# EAGLE design Helmet_Drop_V1.5 (EAGLE 9.6.2)

## Sheet 1 of 2
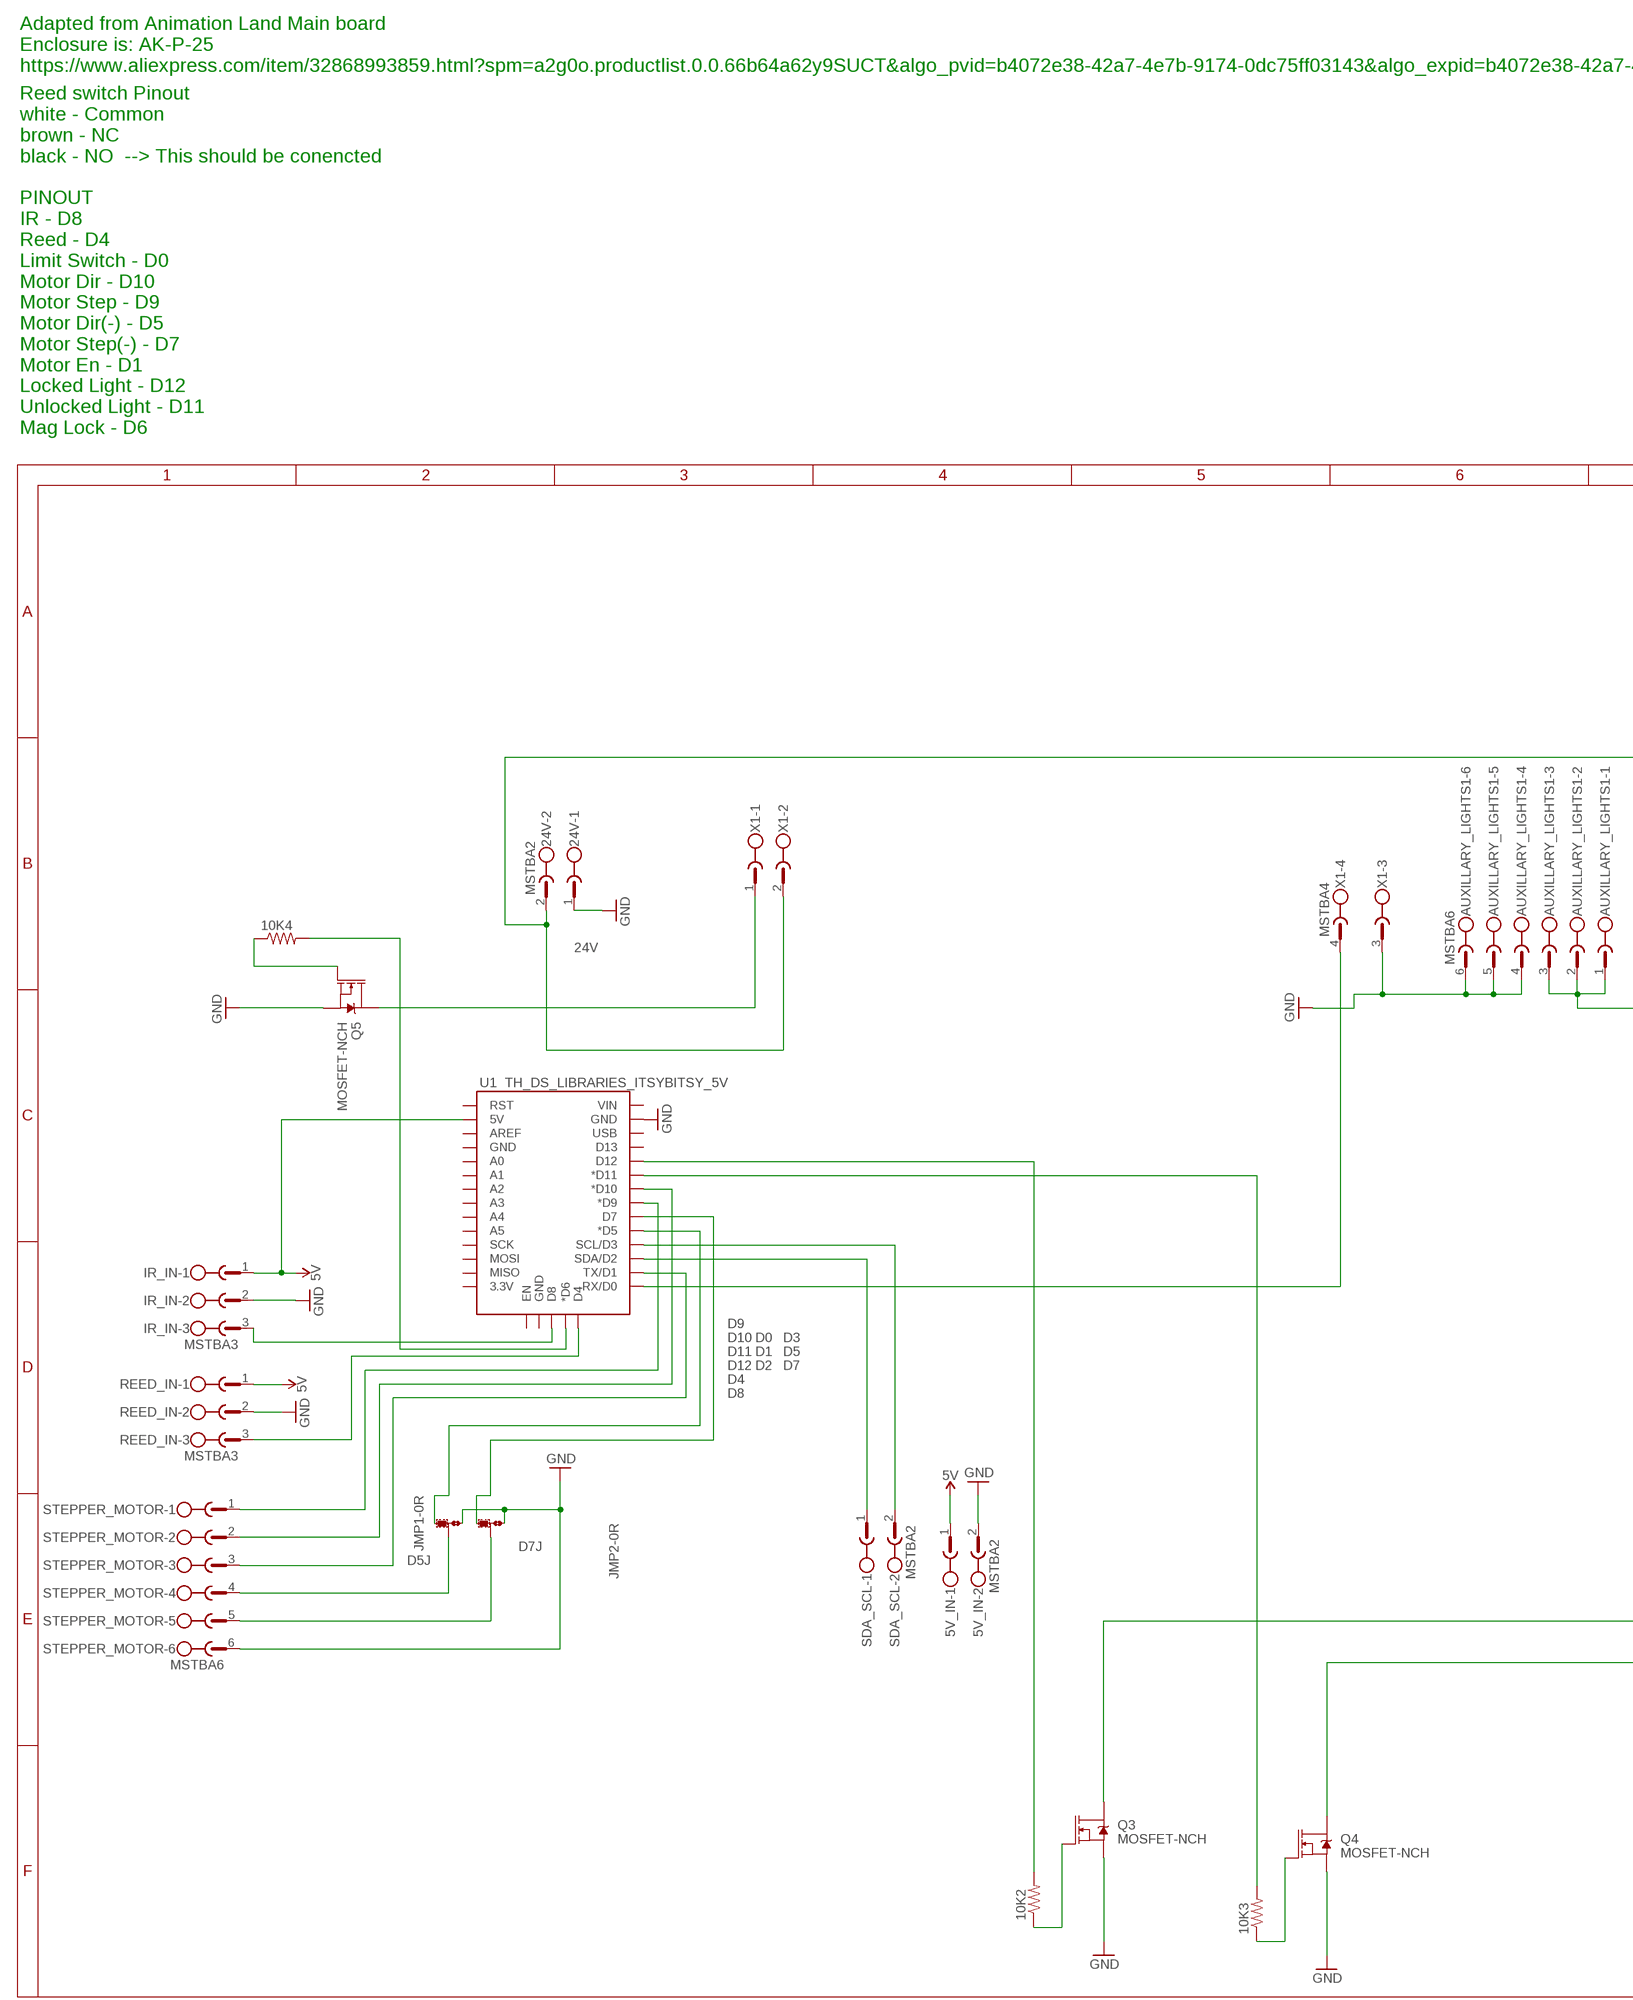
[diagram p0: schematic, sheet 1, part 1 of 2]
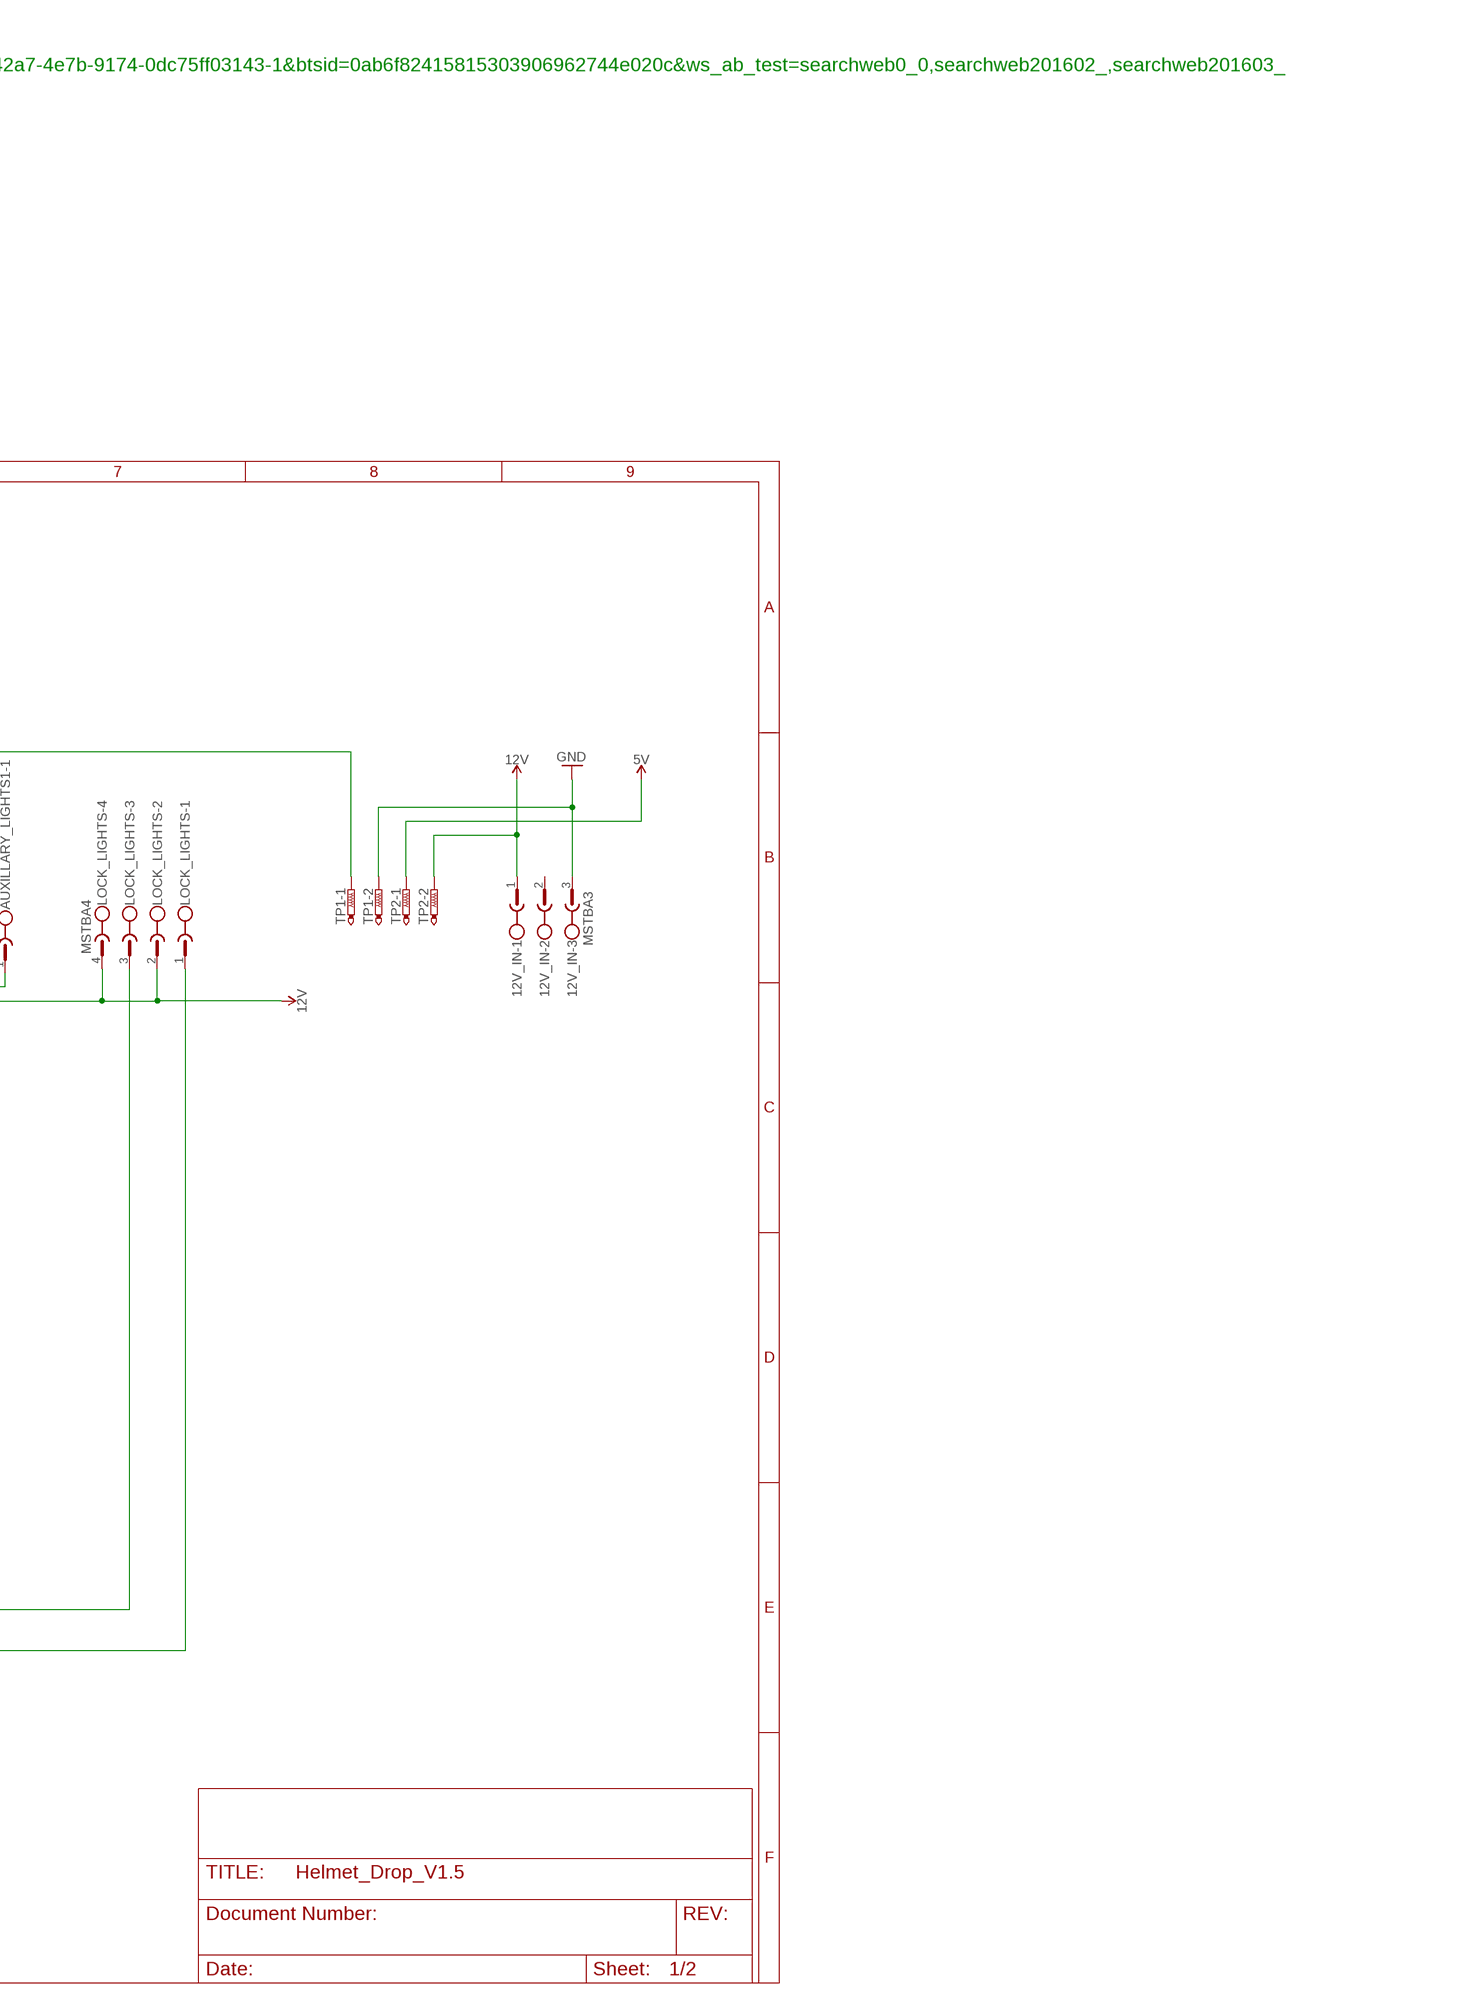
[diagram p1: schematic, sheet 1, part 2 of 2]

### Parts
5V_IN  MSTBA2  [MSTBA2]
10K2  R-US_M0805  [M0805]
10K3  R-US_M0805  [M0805]
10K4  R-US_M0805  [M0805]
12V_IN  MSTBA3  [MSTBA3]
24V  MSTBA2  [MSTBA2]
AUXILLARY_LIGHTS1  MSTBA6  [MSTBA6]
IR_IN  MSTBA3  [MSTBA3]
JMP1  0R-JUMPB  [B0R-JMP]
JMP2  0R-JUMPB  [B0R-JMP]
LOCK_LIGHTS  MSTBA4  [MSTBA4]
Q3  MOSFET-NCH  [SO-8_POWER_PAK]
Q4  MOSFET-NCH  [SO-8_POWER_PAK]
Q5  MOSFET-NCH  [SO-8_POWER_PAK]
REED_IN  MSTBA3  [MSTBA3]
SDA_SCL  MSTBA2  [MSTBA2]
STEPPER_MOTOR  MSTBA6  [MSTBA6]
TP1  PTR2  [P2-38-17]
TP2  PTR2  [P2-38-17]
U1  TH_DS_LIBRARIES_ITSYBITSY_5V  [TH_DS_LIBRARIES_ADAFRUIT_LENOARDO]
X1  MSTBA4  [MSTBA4]

### Nets
5V [High Power]: 5V_IN.1 IR_IN.1 REED_IN.1 TP2.TP-1 U1.5V
12V [High Power]: 12V_IN.1 AUXILLARY_LIGHTS1.1 AUXILLARY_LIGHTS1.2 AUXILLARY_LIGHTS1.3 LOCK_LIGHTS.2 LOCK_LIGHTS.4 TP2.TP-2
24V [High Power]: 24V.2 TP1.TP-1 X1.2
D0 [Low Power]: U1.RX(RX/D0) X1.4
D1 [Low Power]: STEPPER_MOTOR.3 U1.TX(TX/D1)
D2 [Low Power]: SDA_SCL.1 U1.SDA(SDA/D2)
D3 [Low Power]: SDA_SCL.2 U1.SCL(SCL/D3)
D4 [Low Power]: REED_IN.3 U1.D4
D5 [Low Power]: JMP1.3 U1.D5(*D5)
D5J [Low Power]: JMP1.2 STEPPER_MOTOR.4
D7 [Low Power]: JMP2.3 U1.D7
D7J [Low Power]: JMP2.2 STEPPER_MOTOR.5
D8 [Low Power]: IR_IN.3 U1.D8
D9 [Low Power]: STEPPER_MOTOR.1 U1.D9(*D9)
D10 [Low Power]: STEPPER_MOTOR.2 U1.D10(*D10)
D11 [Low Power]: 10K3.2 U1.D11(*D11)
D12 [Low Power]: 10K2.2 U1.D12
GND [High Power]: 5V_IN.2 12V_IN.3 24V.1 AUXILLARY_LIGHTS1.4 AUXILLARY_LIGHTS1.5 AUXILLARY_LIGHTS1.6 IR_IN.2 JMP1.1 JMP2.1 Q3.S Q4.S Q5.S REED_IN.2 STEPPER_MOTOR.6 TP1.TP-2 U1.GND@2(GND) X1.3 ; also sheet 2
N$1 [Low Power]: 10K4.2 U1.D6(*D6)
N$7 [Low Power]: LOCK_LIGHTS.3 Q3.D1(D)
N$10 [Low Power]: LOCK_LIGHTS.1 Q4.D1(D)
N$12 [Low Power]: 10K2.1 Q3.G
N$21 [Low Power]: Q5.D1(D) X1.1
N$27 [Low Power]: 10K3.1 Q4.G
N$28 [Low Power]: 10K4.1 Q5.G
Unconnected: 12V_IN.2 U1.3V(3.3V) U1.A0 U1.A1 U1.A2 U1.A3 U1.A4 U1.A5 U1.AREF U1.D13 U1.EN U1.GND@0(GND) U1.GND@1(GND) U1.MISO U1.MOSI U1.RES(RST) U1.SCK U1.USB U1.VIN

### Notes on the sheet
- Adapted from Animation Land Main board
  Enclosure is: AK-P-25
  https://www.aliexpress.com/item/32868993859.html?spm=a2g0o.productlist.0.0.66b64a62y9SUCT&algo_pvid=b4072e38-42a7-4e7b-9174-0dc75ff03143&algo_expid=b4072e38-42a7-4e7b-9174-0dc75ff03143-1&btsid=0ab6f82415815303906962744e020c&ws_ab_test=searchweb0_0,searchweb201602_,searchweb201603_
- Reed switch Pinout
  white - Common
  brown - NC
  black - NO  --> This should be conencted
  
  PINOUT
  IR - D8
  Reed - D4
  Limit Switch - D0
  Motor Dir - D10
  Motor Step - D9
  Motor Dir(-) - D5
  Motor Step(-) - D7
  Motor En - D1
  Locked Light - D12
  Unlocked Light - D11
  Mag Lock - D6

## Sheet 2 of 2
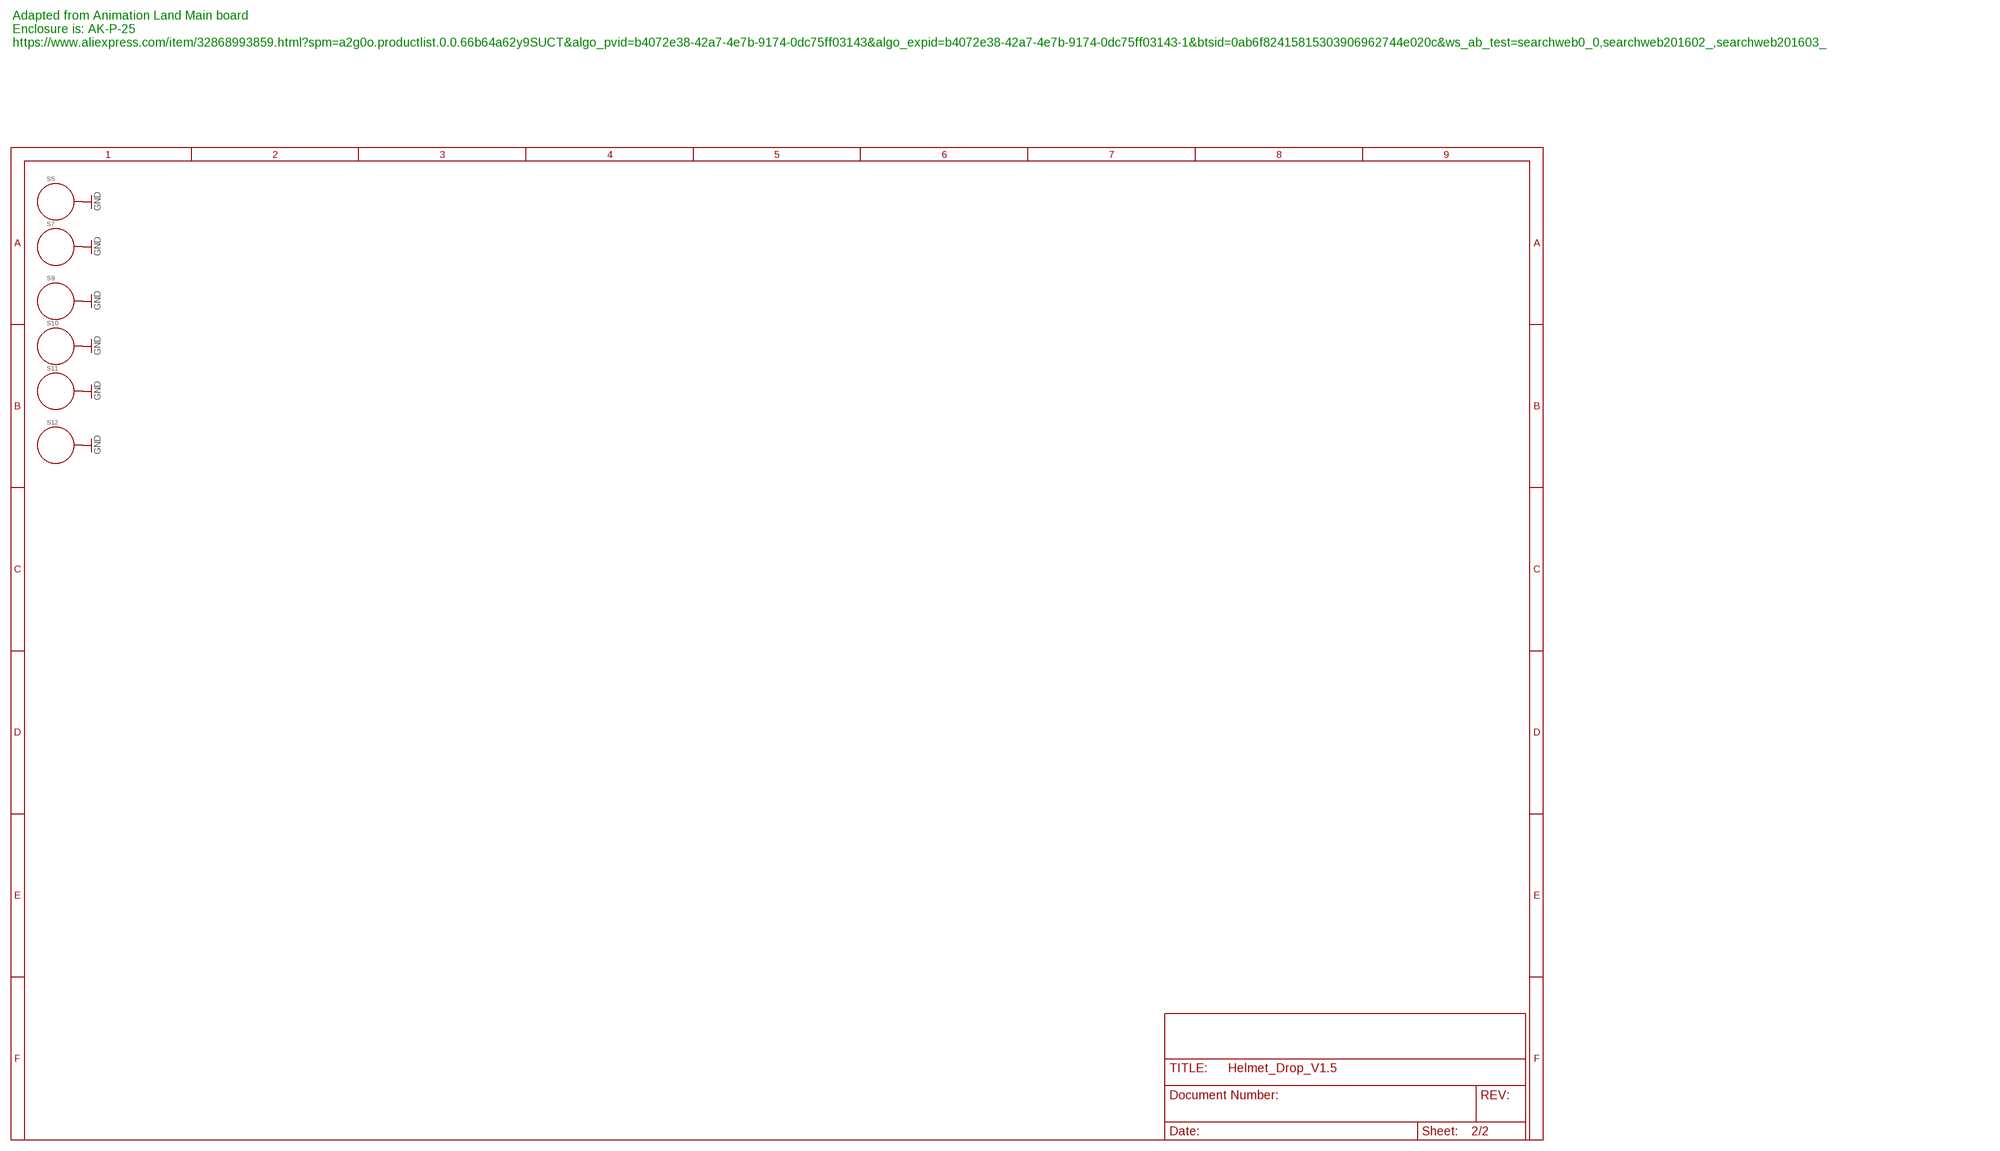
[diagram p2: schematic, sheet 2]

### Parts
S5  STANDOFF_ELECTRICAL5-32  [STANDOFF_ELECTRICAL_5_32]
S7  STANDOFF_ELECTRICAL5-32  [STANDOFF_ELECTRICAL_5_32]
S9  STANDOFF_ELECTRICAL5-32  [STANDOFF_ELECTRICAL_5_32]
S10  STANDOFF_ELECTRICAL5-32  [STANDOFF_ELECTRICAL_5_32]
S11  STANDOFF_ELECTRICAL5-32  [STANDOFF_ELECTRICAL_5_32]
S12  STANDOFF_ELECTRICAL5-32  [STANDOFF_ELECTRICAL_5_32]

### Nets
GND [High Power]: S5.P1 S7.P1 S9.P1 S10.P1 S11.P1 S12.P1 ; also sheet 1

### Notes on the sheet
- Adapted from Animation Land Main board
  Enclosure is: AK-P-25
  https://www.aliexpress.com/item/32868993859.html?spm=a2g0o.productlist.0.0.66b64a62y9SUCT&algo_pvid=b4072e38-42a7-4e7b-9174-0dc75ff03143&algo_expid=b4072e38-42a7-4e7b-9174-0dc75ff03143-1&btsid=0ab6f82415815303906962744e020c&ws_ab_test=searchweb0_0,searchweb201602_,searchweb201603_

## Library data of the parts
5V_IN 24V SDA_SCL = th_libraries:MSTBA2: PHOENIX; MF: FARNELL; MPN: 1757242; OC_FARNELL: 3705171; OC_NEWARK: 71C4161
10K2-10K4 = adafruit:R-US_: RESISTOR, American symbol
12V_IN IR_IN REED_IN = con-phoenix-508:MSTBA3: PHOENIX; MF: FARNELL; MPN: 1757255; OC_FARNELL: 3705183; OC_NEWARK: 71C4162
AUXILLARY_LIGHTS1 STEPPER_MOTOR = con-phoenix-508:MSTBA6: PHOENIX; MF: FARNELL; MPN: 1757284; OC_FARNELL: 3705213; OC_NEWARK: 71C4165
JMP1 JMP2 = jump-0r-smd:0R-JUMP: SMD 0R 0805 Jumper
LOCK_LIGHTS = th_libraries:MSTBA4: PHOENIX; MF: FARNELL; MPN: 1757268; OC_FARNELL: 3705195; OC_NEWARK: 71C4163
Q3-Q5 = th_ds_libraries:MOSFET-NCH: N-channel MOSFETs from Sparkfun-DiscreteSemi Library
S5 S7 S9-S12 = th_libraries:STANDOFF_ELECTRICAL: A standoff intended to be an electrically connected point. Pad size and stop size allow for a #8 Phillips pan screw head to make a solid connection to the board. Added 144mill drill hole that fits my normal wood screw
TP1 TP2 = testpad:PTR2: TEST PIN
U1 = Helmet_Drop_V1.5:TH_DS_LIBRARIES_ITSYBITSY_5V: Adafruit ItsyBitsy 32u4 - 5V 16MHz https://www.adafruit.com/product/3677
X1 = con-phoenix-508:MSTBA4: PHOENIX; MF: FARNELL; MPN: 1757268; OC_FARNELL: 3705195; OC_NEWARK: 71C4163

## Net classes
1 High Power: width 0.406 mm, drill 0.483 mm
2 Low Power: width 0.305 mm, drill 0.483 mm

## Board
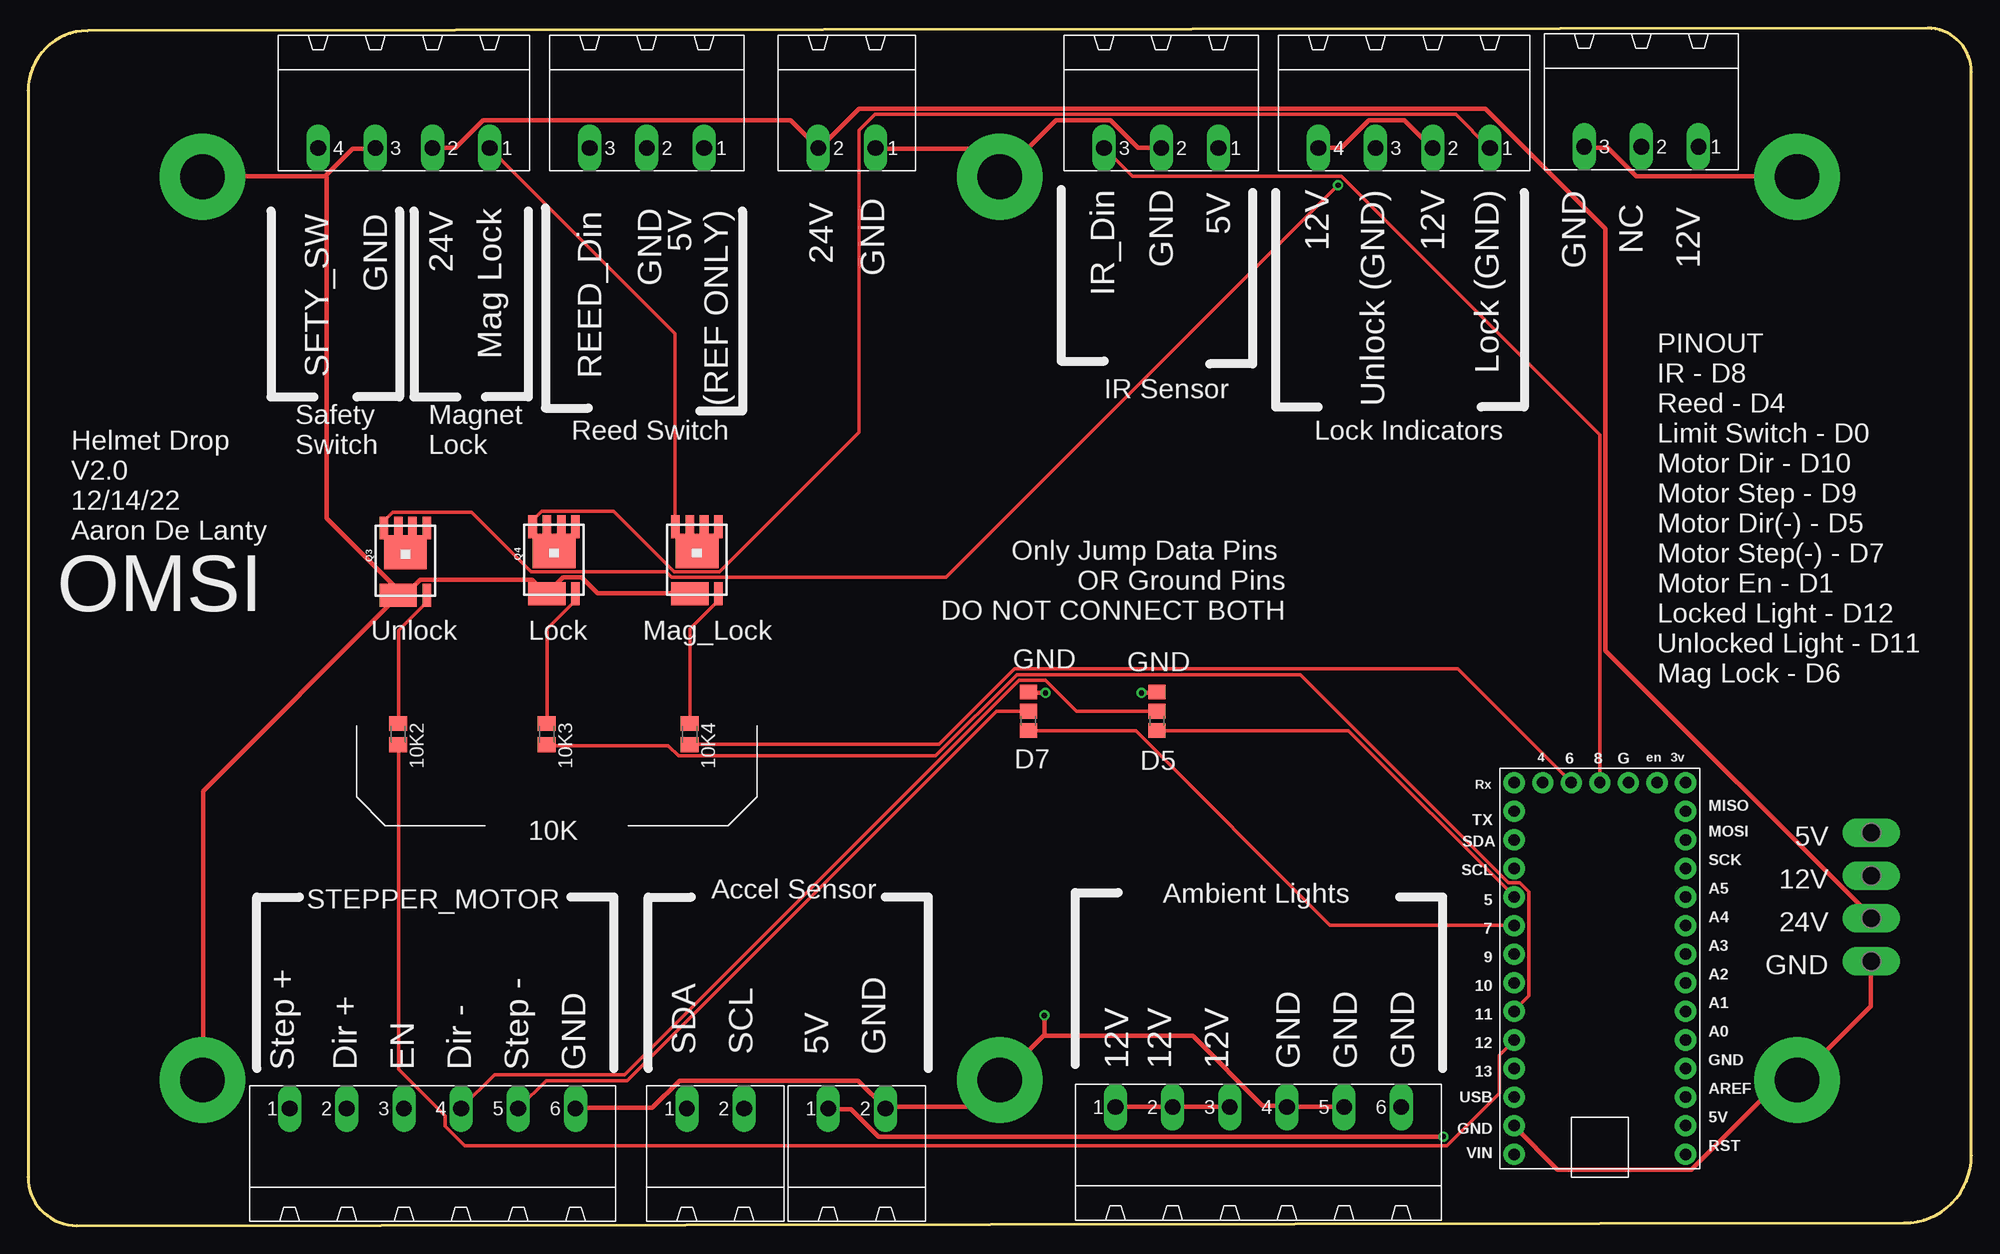
[diagram p3: board, top side]
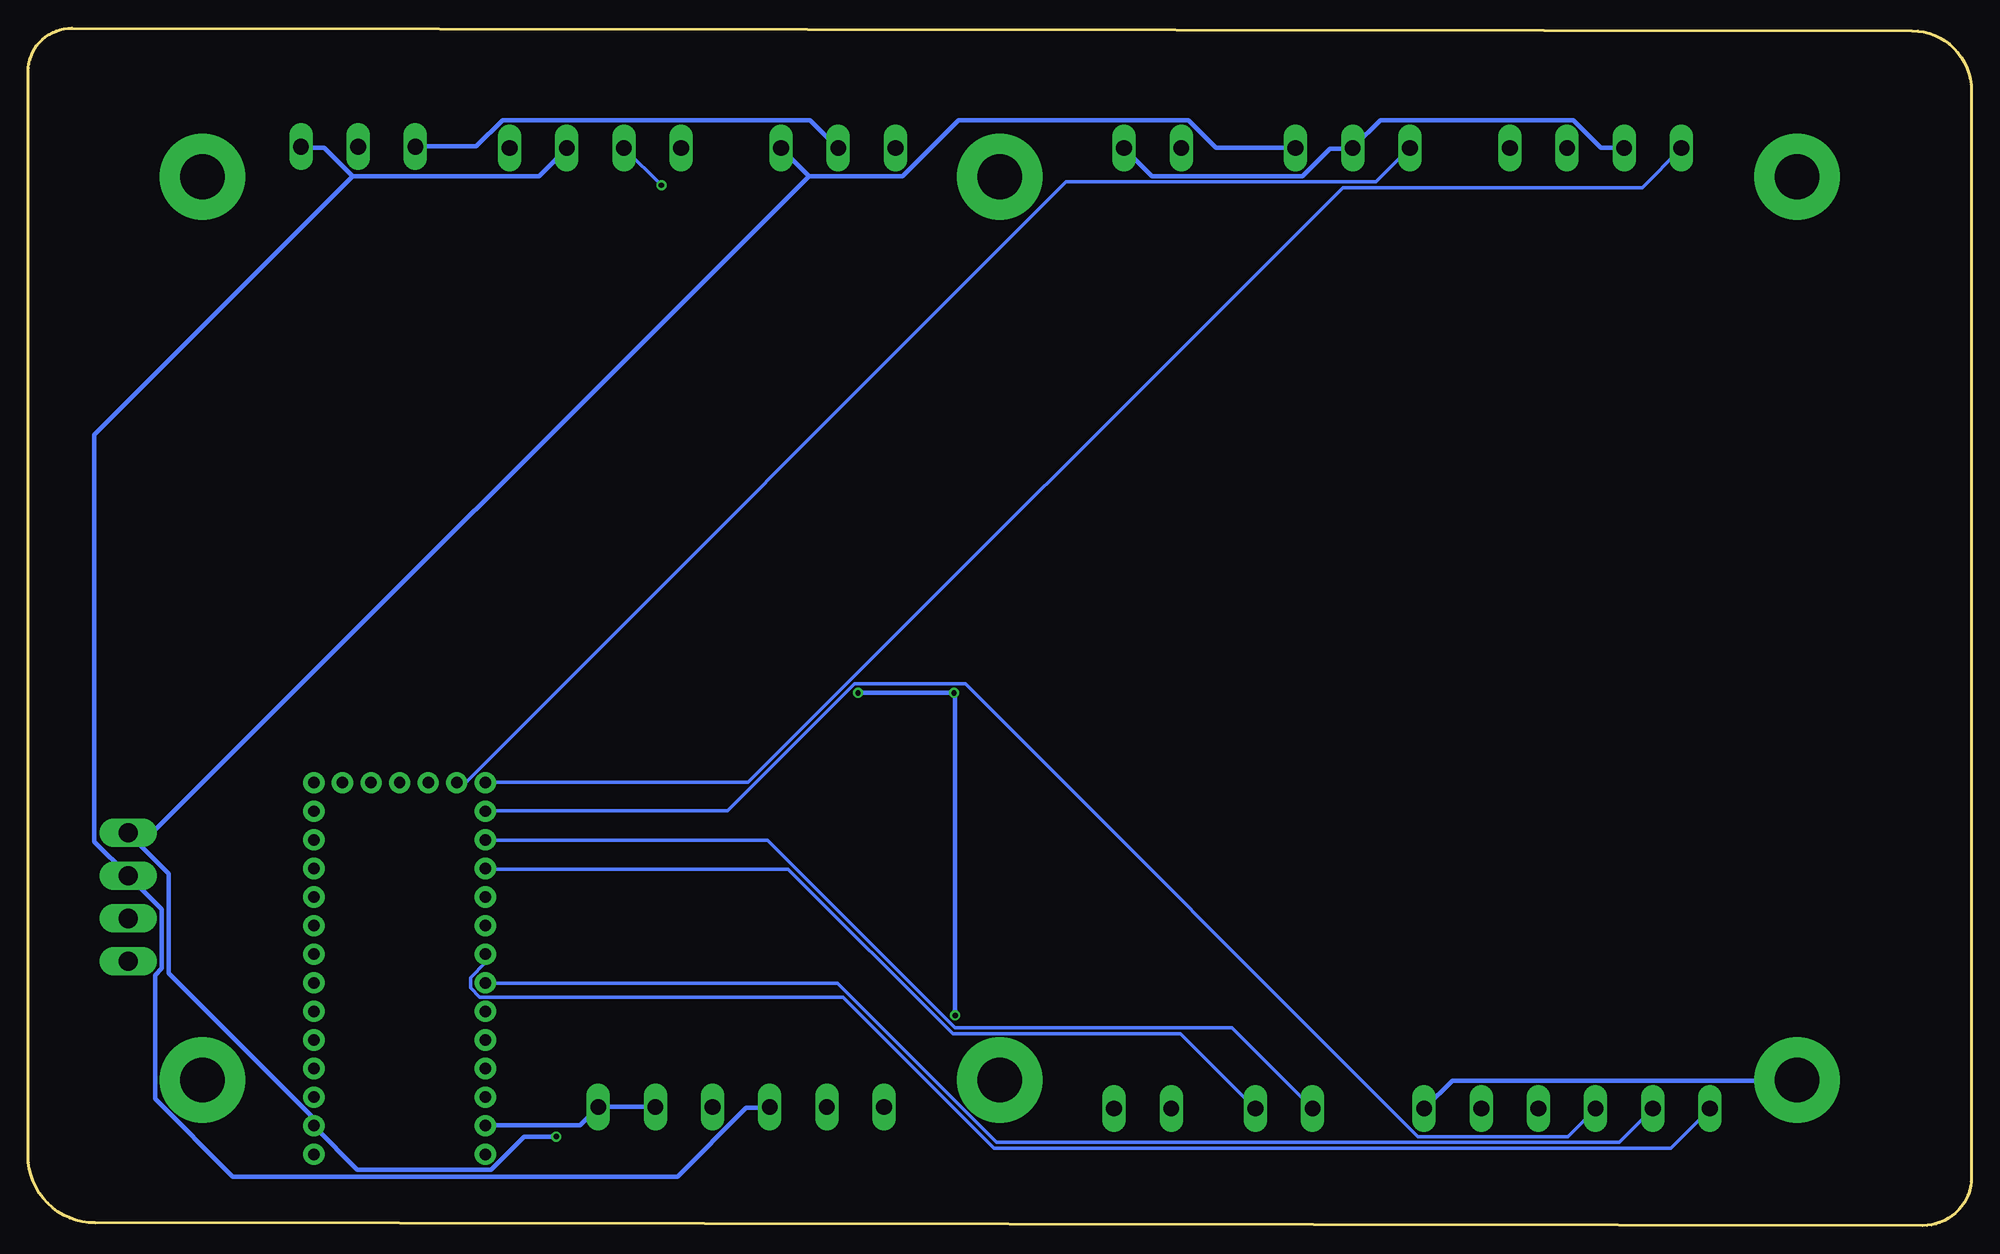
[diagram p4: board, bottom side, seen from below]

Size 172.72 x 106.41 mm. Coordinates in mm from the lower left corner, seen from the top.
Outline: 168.83,106.41 5.28,106.17 arc90 0,100.89 0,4.33 arc90 4.33,0 166.75,0.24 arc90 172.72,6.22 172.72,102.53 arc90 168.83,106.41
Copper layers (1*16): Top 0.035mm / dielectric 1.5mm / Bottom 0.035mm
Design rules "default *": minimum track width 10mil, minimum drill 0.35mm, track to track 6mil, track to pad 6mil, pad to pad 6mil, via to via 6mil, smd to smd 6mil, copper to edge 40mil, drill to drill 6mil, minimum pad ring 10mil, minimum via ring 8mil, stop-mask expansion 4mil, vias tented up to drill 0mil, thermal gap 10mil

### Footprints (pad centres in the part's own frame; a part is rotated, then mirrored left to right if it is on the bottom)
MSTBA2 = drill 1.397 long: 1 -2.54,5.08; 2 2.54,5.08
M0805 = smd 1.3 x 1.6: 1 -0.95,0; 2 0.95,0
MSTBA3 = drill 1.397 long: 1 -5.08,5.08; 2 0,5.08; 3 5.08,5.08
MSTBA6 = drill 1.397 long: 1 -12.7,5.08; 2 -7.62,5.08; 3 -2.54,5.08; 4 2.54,5.08; 5 7.62,5.08; 6 12.7,5.08
B0R-JMP = smd 1.5 x 1.3: 1 0,1.7; 2 0,0; 3 0,-1.7
MSTBA4 = drill 1.397 long: 1 -7.62,5.08; 2 -2.54,5.08; 3 2.54,5.08; 4 7.62,5.08
SO-8_POWER_PAK = smd 0.762 x 2.032: D1 -3.423,2.437; D2 -2.153,2.437; D3 -0.883,2.437; D4 0.387,2.437; G 0.387,-3.532 | smd 3.81 x 3.048: D5 -1.518,0.278 | smd 3.302 x 2.032: S -2.153,-3.532
STANDOFF_ELECTRICAL_5_32 = drill 3.969 pad 7.62: P1 0,0
P2-38-17 = drill 1.702 pad 2.121 long: TP-1 -1.905,0; TP-2 1.905,0
TH_DS_LIBRARIES_ADAFRUIT_LENOARDO = drill 1.016 pad 1.88: 3V -10.16,-21.59; 5V -10.16,8.89; A0 -10.16,1.27; A1 -10.16,-1.27; A2 -10.16,-3.81; A3 -10.16,-6.35; A4 -10.16,-8.89; A5 -10.16,-11.43; AREF -10.16,6.35; D4 2.54,-21.59; D5 5.08,-11.43; D6 0,-21.59; D7 5.08,-8.89; D8 -2.54,-21.59; D9 5.08,-6.35; D10 5.08,-3.81; D11 5.08,-1.27; D12 5.08,1.27; D13 5.08,3.81; EN -7.62,-21.59; GND@0 -10.16,3.81; GND@1 -5.08,-21.59; GND@2 5.08,8.89; MISO -10.16,-19.05; MOSI -10.16,-16.51; RES -10.16,11.43; RX 5.08,-21.59; SCK -10.16,-13.97; SCL 5.08,-13.97; SDA 5.08,-16.51; TX 5.08,-19.05; USB 5.08,6.35; VIN 5.08,11.43

### Placement (x,y rotation side)
5V_IN  73.66,5.33 0 top
10K2  32.89,43.68 270 top
10K3  46.1,43.68 270 top
10K4  58.8,43.68 270 top
12V_IN  143.38,100.96 180 top
24V  72.77,100.83 180 top
AUXILLARY_LIGHTS1  109.35,5.45 0 top
IR_IN  100.71,100.83 180 top
JMP1  100.33,45.71 0 top
JMP2  88.9,45.71 0 top
LOCK_LIGHTS  122.3,100.83 180 top
Q3  35.05,59.56 0 top
Q4  48.26,59.68 0 top
Q5  60.96,59.68 0 top
REED_IN  54.99,100.83 180 top
S5  15.49,93.21 0 top
S7  86.36,12.95 0 top
S9  15.49,12.95 0 top
S10  86.36,93.21 0 top
S11  157.23,12.95 0 top
S12  157.23,93.21 0 top
SDA_SCL  61.09,5.33 0 top
STEPPER_MOTOR  35.94,5.33 0 top
TP1  163.83,25.39 270 top
TP2  163.83,33.01 270 top
U1  137.16,17.77 180 top
X1  33.4,100.83 180 top

### Tracks (layer width: path | path; a pad name or v marks a point on that pad's centre or on a via)
5V  (via drill 0.48)
  Top 0.406: v125.78,7.92 75.59,7.92 73.15,10.36 71.12,10.36 5V_IN.1
  Bottom 0.406: 103.33,93.26 95,93.26 90.02,98.24 69.6,98.24 67.16,95.8 60.15,95.8 REED_IN.1 | 103.33,93.26 105.77,95.7 IR_IN.1 | v125.78,7.92 128.63,7.92 131.57,4.97 143.46,4.97 147.22,8.73 U1.5V 147.32,9.54 160.22,22.45 160.22,31.29 163.78,34.84 TP2.TP-1 162.66,33.93 103.33,93.26
12V
  Top 0.406: AUXILLARY_LIGHTS1.1 96.72,10.56 101.7,10.56 AUXILLARY_LIGHTS1.2 101.91,10.56 106.78,10.56 AUXILLARY_LIGHTS1.3 | LOCK_LIGHTS.4 114.71,95.8 116.74,95.8 119.18,98.24 122.33,98.24 124.77,95.8 LOCK_LIGHTS.2
  Bottom 0.406: 143.87,93.26 146.41,95.8 148.44,95.8 12V_IN.1 | 143.87,93.26 127.31,93.26 124.87,95.7 LOCK_LIGHTS.2 | 143.87,93.26 166.83,70.3 166.83,34.13 163.88,31.18 TP2.TP-2 163.68,30.98 160.83,28.14 160.83,22.85 161.44,22.24 161.44,11.27 154.53,4.36 115.01,4.36 108.92,10.46 106.88,10.46 AUXILLARY_LIGHTS1.3
24V
  Top 0.406: X1.2 35.97,95.8 38,95.8 40.44,98.24 67.77,98.24 70.21,95.8 24V.2 70.41,95.8 73.86,99.26 129.54,99.26 140.21,88.59 140.21,51.1 163.78,27.53 163.78,27.32 TP1.TP-1
D0
  Bottom 0.305: U1.RX 132.08,39.41 108.71,39.41 55.88,92.25 29.26,92.25 25.81,95.7 X1.4
D1
  Bottom 0.305: U1.TX 132.08,36.87 110.54,36.87 99.26,48.15 89.41,48.15 49.17,7.92 35.87,7.92 33.43,10.36 STEPPER_MOTOR.3
D2
  Bottom 0.305: U1.SDA 132.08,34.23 106.98,34.23 90.32,17.57 65.73,17.57 58.62,10.46 SDA_SCL.1
D3
  Bottom 0.305: U1.SCL 132.08,31.69 105.16,31.69 90.53,17.06 70.31,17.06 63.7,10.46 SDA_SCL.2
D4
  Bottom 0.305: U1.D4 134.62,39.41 133.81,39.41 80.47,92.75 52.93,92.75 49.99,95.7 REED_IN.3
D5
  Top 0.305: JMP1.3 100.38,43.99 117.35,43.99 132.08,29.25 U1.D5
D5J
  Top 0.305: JMP1.2 93.17,45.71 90.42,48.46 88.09,48.46 53.03,13.4 41.45,13.4 38.51,10.46 STEPPER_MOTOR.4
D7
  Top 0.305: JMP2.3 88.9,43.99 98.45,43.99 115.72,26.71 132.08,26.71 U1.D7
D7J
  Top 0.305: JMP2.2 86.06,45.71 53.24,12.9 46.02,12.9 43.59,10.46 STEPPER_MOTOR.5
D8
  Top 0.305: U1.D8 139.7,70.3 116.74,93.26 98.15,93.26 95.71,95.7 IR_IN.3
D9
  Bottom 0.305: U1.D9 132.08,23.36 133.4,22.04 133.4,21.13 132.59,20.31 100.28,20.31 86.87,6.9 26.72,6.9 23.27,10.36 STEPPER_MOTOR.1
D10
  Bottom 0.305: U1.D10 132.08,21.53 100.79,21.53 86.67,7.41 31.29,7.41 28.35,10.36 STEPPER_MOTOR.2
D11
  Top 0.305: 10K3.2 46.13,42.67 56.9,42.67 57.81,41.75 80.67,41.75 87.88,48.96 113.08,48.96 131.57,30.47 132.59,30.47 133.4,29.66 133.4,20.42 132.08,19.09 U1.D11
D12
  Top 0.305: 10K2.2 32.92,42.67 32.92,13.91 37.08,9.75 37.08,8.83 38.81,7.11 126.09,7.11 130.76,11.78 130.76,15.13 132.08,16.45 U1.D12
GND  (via drill 0.48)
  Top 0.406: TP1.TP-2 163.78,23.46 163.78,19.5 S11.P1 157.07,12.9 155.75,12.9 147.83,4.97 135.94,4.97 132.08,8.83 U1.GND@2 | STEPPER_MOTOR.6 48.67,10.46 55.47,10.46 57.91,12.9 73.76,12.9 76.2,10.46 5V_IN.2 76.3,10.56 84.02,10.56 86.26,12.8 S7.P1 86.36,13 90.32,16.96 | AUXILLARY_LIGHTS1.5 116.94,10.56 111.96,10.56 AUXILLARY_LIGHTS1.4 111.76,10.66 109.73,10.66 103.53,16.86 90.42,16.86 90.32,16.96 | v90.42,47.34 88.9,47.34 JMP2.1 | v98.96,47.34 100.28,47.34 JMP1.1 | 90.32,16.96 v90.32,18.69 | Q3.S 32.92,56.08 33.53,56.08 34.85,57.4 44.81,57.4 46.02,56.18 Q4.S 46.23,56.28 47.55,57.6 49.17,57.6 50.6,56.18 58.73,56.18 Q5.S | 26.42,93.26 28.85,95.7 30.79,95.7 X1.3 | 26.42,93.26 15.54,93.26 S5.P1 | Q3.S 32.92,56.28 32.92,56.48 26.52,62.88 26.52,93.16 26.42,93.26 | 12V_IN.3 138.38,95.8 140.41,95.8 142.95,93.26 157.18,93.26 S12.P1 | IR_IN.2 100.69,95.8 98.65,95.8 96.22,98.24 91.34,98.24 86.36,93.26 S10.P1 86.26,93.36 83.92,95.7 75.39,95.7 24V.1 | S9.P1 15.54,13 15.54,38.6 32.82,55.87 Q3.S
  Bottom 0.406: U1.GND@2 132.08,8.93 123.65,8.93 AUXILLARY_LIGHTS1.6 121.92,10.56 117.04,10.56 AUXILLARY_LIGHTS1.5 | v98.96,47.34 v90.42,47.34 90.32,47.24 v90.32,18.69 | S9.P1 15.54,12.9 46.13,12.9 48.56,10.46 STEPPER_MOTOR.6 | 24V.1 75.29,95.7 72.85,93.26 59.44,93.26 57,95.7 55.07,95.7 REED_IN.2 54.86,95.9 52.53,98.24 35.36,98.24 32.92,95.8 30.89,95.8 X1.3 | 12V_IN.3 138.28,95.9 132.89,95.9 130.56,98.24 103.23,98.24 100.79,95.8 IR_IN.2
N$1
  Top 0.305: 10K4.2 58.83,42.77 80.97,42.77 87.68,49.47 127.1,49.47 137.16,39.41 U1.D6
N$7  (via drill 0.48)
  Top 0.305: v116.43,92.45 81.58,57.6 57.2,57.6 56.69,58.11 44.7,58.11 39.42,63.39 32.41,63.39 31.7,62.68 31.7,62.07 Q3.D1
  Bottom 0.305: v116.43,92.45 119.69,95.7 LOCK_LIGHTS.3
N$10
  Top 0.305: Q4.D1 44.91,62.17 44.91,62.78 45.62,63.49 52.02,63.49 57.4,58.11 61.47,58.11 73.86,70.5 73.86,97.33 75.29,98.75 126.9,98.75 129.84,95.8 LOCK_LIGHTS.1
N$12
  Top 0.305: 10K2.1 32.92,44.7 32.92,52.93 35.36,55.37 35.36,55.98 Q3.G
N$21
  Top 0.305: Q5.D1 57.51,62.17 57.51,79.24 41.05,95.7 X1.1
N$27
  Top 0.305: 10K3.1 46.13,44.7 46.13,53.03 48.56,55.47 48.56,56.08 Q4.G
N$28
  Top 0.305: 10K4.1 58.83,44.7 58.83,53.03 61.27,55.47 61.27,56.08 Q5.G

### Text on the board
tNames: IR_Din | GND | 5V | 12V | Unlock (GND) | 12V | Lock (GND) | 24V | GND | SFTY_SW | GND | 24V | Mag Lock | REED_Din | GND | 5V / (REF ONLY) | NC | GND | 12V | IR Sensor | Reed Switch | Lock Indicators | Safety / Switch | Magnet / Lock | Helmet Drop / V2.0 / 12/14/22 / Aaron De Lanty | Only Jump Data Pins / OR Ground Pins / DO NOT CONNECT BOTH | OMSI | Unlock | Lock | Mag_Lock | GND | GND | PINOUT / IR - D8 / Reed - D4 / Limit Switch - D0 / Motor Dir - D10 / Motor Step - D9 / Motor Dir(-) - D5 / Motor Step(-) - D7 / Motor En - D1 / Locked Light - D12 / Unlocked Light - D11 / Mag Lock - D6 | D7 | D5 | 5V | 10K | 12V | Accel Sensor | Ambient Lights | 24V | GND | SDA | SCL | 5V | GND | Step + | Dir + | EN | Dir - | Step - | GND | 12V | 12V | 12V | GND | GND | GND